# EAGLE schematic test2 (EAGLE 7.2.0)

## Sheet 1 of 6
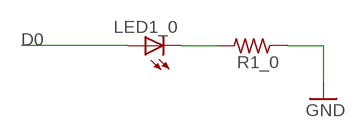
[diagram p0: schematic, sheet 1]

### Parts
LED1_0  LED10MM  [LED10MM]
R1_0  R-US_0204/5  [0204/5]

### Nets
D0: LED1_0.A ; also sheet 3
GND: R1_0.1 ; also sheet 2,3,6
N$1_0: LED1_0.K(C) R1_0.2

## Sheet 2 of 6
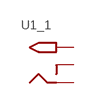
[diagram p1: schematic, sheet 2]

### Parts
U1_1  2.1MMJACKTHM  [PJ-102A]

### Nets
GND: U1_1.RING ; also sheet 1,3,6
RING_SW_1: U1_1.RING_SW
TIP: U1_1.TIP ; also sheet 3,4,5,6

## Sheet 3 of 6
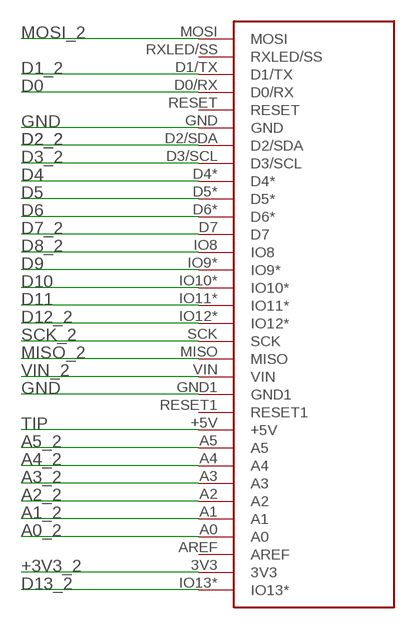
[diagram p2: schematic, sheet 3]

### Parts
U$2_2  ARDUINO_MICRO_REV03J-BOB  [ARDUINO_MICRO_REV03J]

### Nets
+3V3_2: U$2_2.3V3
A0_2: U$2_2.A0
A1_2: U$2_2.A1
A2_2: U$2_2.A2
A3_2: U$2_2.A3
A4_2: U$2_2.A4
A5_2: U$2_2.A5
D0: U$2_2.D0/RX ; also sheet 1
D1_2: U$2_2.D1/TX
D2_2: U$2_2.D2/SDA
D3_2: U$2_2.D3/SCL
D4: U$2_2.D4* ; also sheet 4
D5: U$2_2.D5* ; also sheet 4
D6: U$2_2.D6* ; also sheet 4
D7_2: U$2_2.D7
D8_2: U$2_2.IO8
D9: U$2_2.IO9* ; also sheet 5
D10: U$2_2.IO10* ; also sheet 5
D11: U$2_2.IO11* ; also sheet 5
D12_2: U$2_2.IO12*
D13_2: U$2_2.IO13*
GND: U$2_2.GND U$2_2.GND1 ; also sheet 1,2,6
MISO_2: U$2_2.MISO
MOSI_2: U$2_2.MOSI
SCK_2: U$2_2.SCK
TIP: U$2_2.+5V ; also sheet 2,4,5,6
VIN_2: U$2_2.VIN
Unconnected: U$2_2.AREF U$2_2.RESET U$2_2.RESET1 U$2_2.RXLED/SS

## Sheet 4 of 6
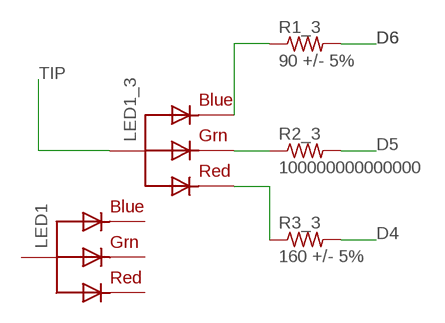
[diagram p3: schematic, sheet 4]

### Parts
LED1  RGBLED_CA-5MM  [LED5MMRGB]
LED1_3  RGBLED_CA-5MM  [LED5MMRGB]
R1_3  90 +/- 5%  GENERIC-RESISTOR_1608-0603_CERAMIC  [RESC1608X55HS]
R2_3  100000000000000  GENERIC-RESISTOR_1608-0603_CERAMIC  [RESC1608X55HS]
R3_3  160 +/- 5%  GENERIC-RESISTOR_1608-0603_CERAMIC  [RESC1608X55HS]

### Nets
D4: R3_3.2 ; also sheet 3
D5: R2_3.2 ; also sheet 3
D6: R1_3.2 ; also sheet 3
N$1_3: LED1_3.4(BLUE) R1_3.1
N$2_3: LED1_3.3(GREEN) R2_3.1
N$3_3: LED1_3.1(RED) R3_3.1
TIP: LED1_3.2(VCC) ; also sheet 2,3,5,6
Unconnected: LED1.1(RED) LED1.2(VCC) LED1.3(GREEN) LED1.4(BLUE)

## Sheet 5 of 6
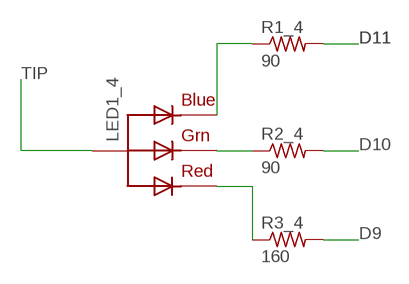
[diagram p4: schematic, sheet 5]

### Parts
LED1_4  RGBLED_CA-5MM  [LED5MMRGB]
R1_4  90  RESISTOR-TH-1/6W  [RESAD350W45L370D210P]
R2_4  90  RESISTOR-TH-1/6W  [RESAD350W45L370D210P]
R3_4  160  RESISTOR-TH-1/6W  [RESAD350W45L370D210P]

### Nets
D9: R3_4.2 ; also sheet 3
D10: R2_4.2 ; also sheet 3
D11: R1_4.2 ; also sheet 3
N$1_4: LED1_4.4(BLUE) R1_4.1
N$2_4: LED1_4.3(GREEN) R2_4.1
N$3_4: LED1_4.1(RED) R3_4.1
TIP: LED1_4.2(VCC) ; also sheet 2,3,4,6

## Sheet 6 of 6
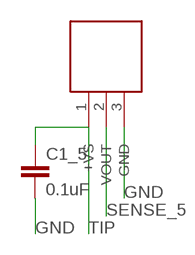
[diagram p5: schematic, sheet 6]

### Parts
C1_5  0.1uF  CAPACITOR-0805-0.1UF-10%-25V  [CAPC2012X86N]
U1_5  TMP36  TEMP-SENSOR-TMP36-SPARKFUN10988-TH  [TO127P521H533-3P]

### Nets
GND: C1_5.2 ; also sheet 1,2,3
TIP: C1_5.1 ; also sheet 2,3,4,5
Unconnected: U1_5.1(+VS) U1_5.2(VOUT) U1_5.3(GND)

## Library data of the parts
C1_5 = Capacitors:CAPACITOR; CREATOR: Swanson; DATASHEET: GRM2195C1H103JA01-01.pdf; DIST: Digikey; DISTPN: GRM Series; KIT: Adafruit 441; MFR: Murata; MOUNT: 0805; TOLERANCE: 10%; VOLTS: 25V
LED1 = Components:RGBLED_CA: RGB LED, common-anode 5MM Staggered pins 5mm Piranha package http://www.ladyada.net/library/pcb/eaglelibrary.html; CREATOR: Swanson; FIELD_OF_VIEW: 55
LED1_0 = Components:LED: LED OSRAM: - CHIPLED LG R971, LG N971, LY N971, LG Q971, LY Q971, LO R971, LY R971 LH N974, LH R974 LS Q976, LO Q976, LY Q976 LO Q996 - Hyper CHIPLED LW Q18S LB Q993, LB Q99A, LB R99A - SideLED LS A670, LO A670, LY A670, LG A670, LP A670 LB A673, LV A673, LT A673, LW A673 LH A674 LY A675 LS A676, LA A676, LO A676, LY A676, LW A676 LS A679, LY A679, LG A679 - Hyper Micro SIDELED® LS Y876, LA Y876, LO Y876, LY Y876 LT Y87S - SmartLED LW L88C, LW L88S LB L89C, LB L89S, LG L890 LS L89K, LO L89K, LY L89K LS L896, LA L896, LO L896, LY L896 - TOPLED LS T670, LO T670, LY T670, LG T670, LP T670 LSG T670, LSP T670, LSY T670, LOP T670, LYG T670 LG T671, LOG T671, LSG T671 LB T673, LV T673, LT T673, LW T673 LH T674 LS T676, LA T676, LO T676, LY T676, LB T676, LH T676, LSB T676, LW T676 LB T67C, LV T67C, LT T67C, LS T67K, LO T67K, LY T67K, LW E67C LS E67B, LA E67B, LO E67B, LY E67B, LB E67C, LV E67C, LT E67C LW T67C LS T679, LY T679, LG T679 LS T770, LO T770, LY T770, LG T770, LP T770 LB T773, LV T773, LT T773, LW T773 LH T774 LS E675, LA E675, LY E675, LS T675 LS T776, LA T776, LO T776, LY T776, LB T776 LHGB T686 LT T68C, LB T68C - Hyper Mini TOPLED® LB M676 - Mini TOPLED Santana® LG M470 LS M47K, LO M47K, LY M47K Source: http://www.osram.convergy.de/
LED1_3 LED1_4 = Components:RGBLED_CA: RGB LED, common-anode 5MM Staggered pins 5mm Piranha package http://www.ladyada.net/library/pcb/eaglelibrary.html; CREATOR: Swanson
R1_0 = resistor:R-US_: RESISTOR, American symbol
R1_3 R2_3 R3_3 = NVSL:GENERIC-RESISTOR_: Generic resistor
R1_4 R2_4 R3_4 = Components:RESISTOR; CREATOR: Swanson; DIST-1: Digikey; DIST-1-PN: EBK-ND; MFR: Yageo; MFR-PN: CFR-12
U1_1 = Components:2.1MMJACK: 2.1mm x 5.5mm THM DC jack with internal switch. Digikey part #PJ-102A, 4UCON part #05537 2.1mm x 5.5mm SMT DC jack with internal switch. Digikey part #PJ-002A-SMT, 4UCON part #03267 By microbuilder.eu & adafruit.com
U1_5 = Components:TEMP-SENSOR-TMP36-SPARKFUN10988
U$2_2 = BOBs:ARDUINO_MICRO_REV03J: Arduino Micro with Headers - 5V 16MHz